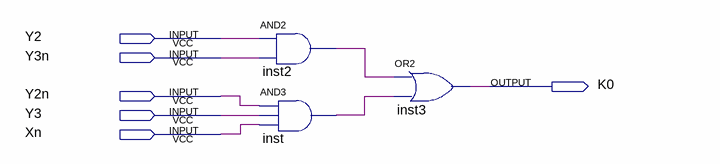
[diagram p0: schematic sheet]
// Quartus schematic K0.bdf as structural Verilog: 3 symbols, 6 pins
module K0 (
  input  Y2,
  input  Y3n,
  input  Y2n,
  input  Y3,
  input  Xn,
  output K0
);

  wire inst2_out, inst_out;

  and inst2 (inst2_out, Y2, Y3n);
  and inst (inst_out, Y2n, Y3, Xn);
  or inst3 (K0, inst2_out, inst_out);
endmodule
